# EAGLE schematic spectrometer_mother_board_v1 (EAGLE 9.2.2)
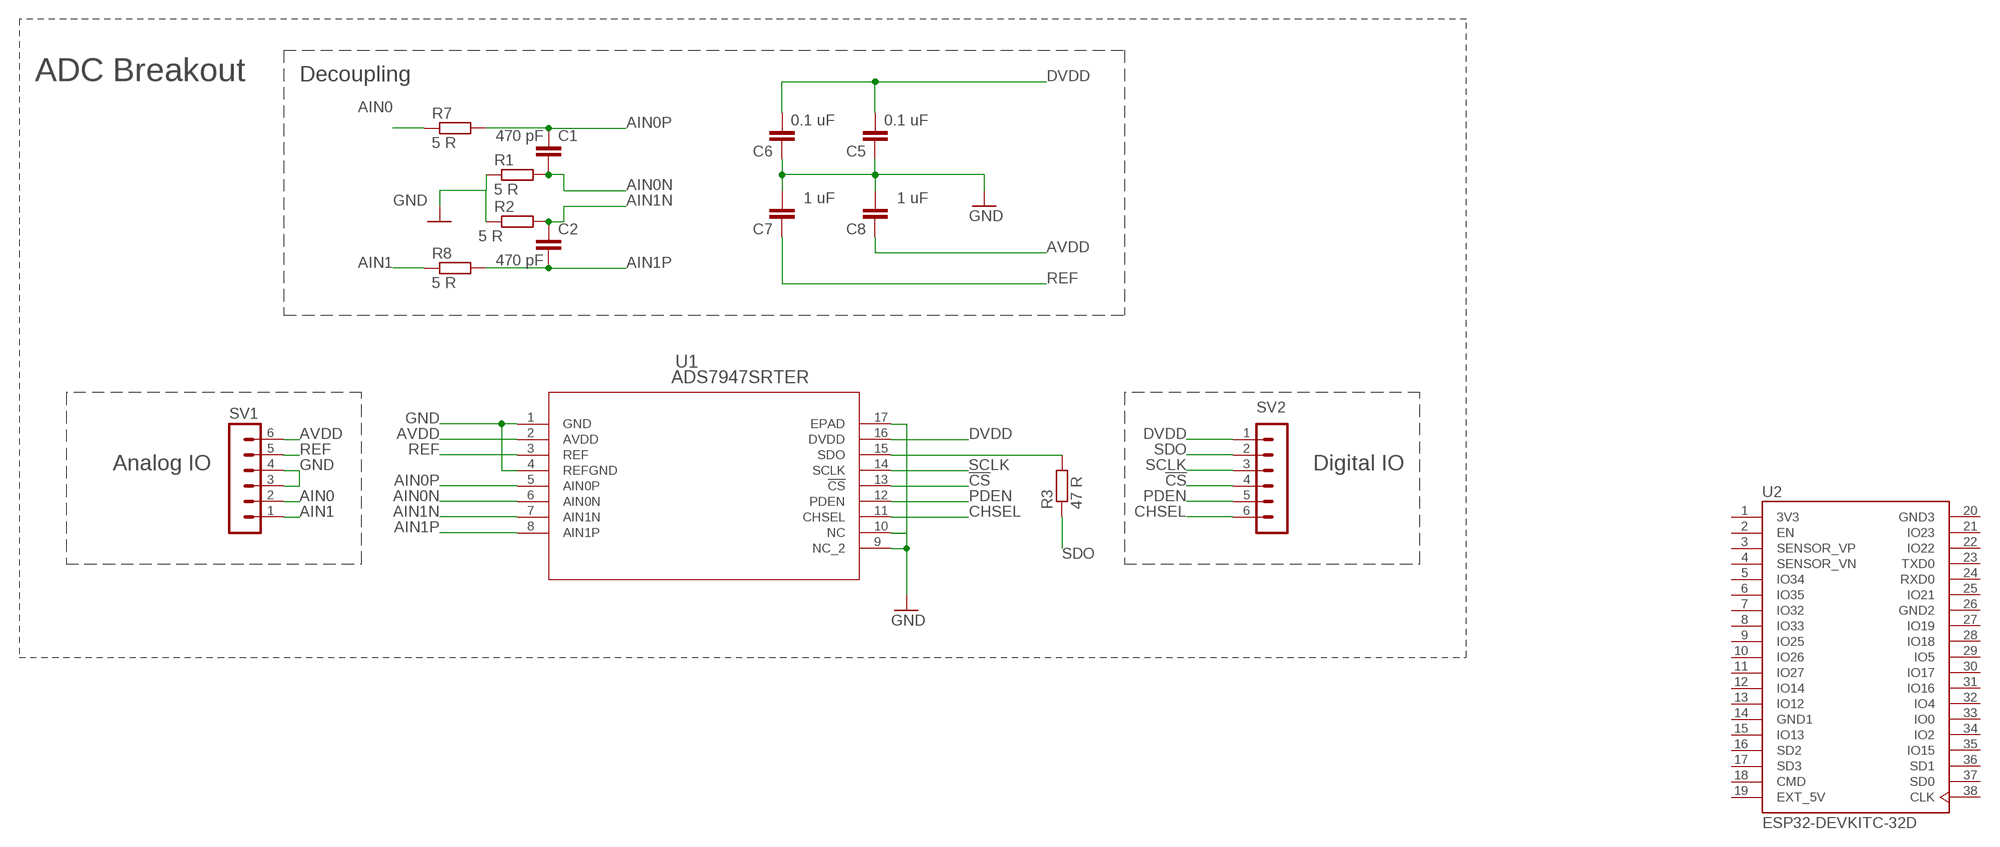
[diagram p0: schematic, sheet 1, part 1 of 2]
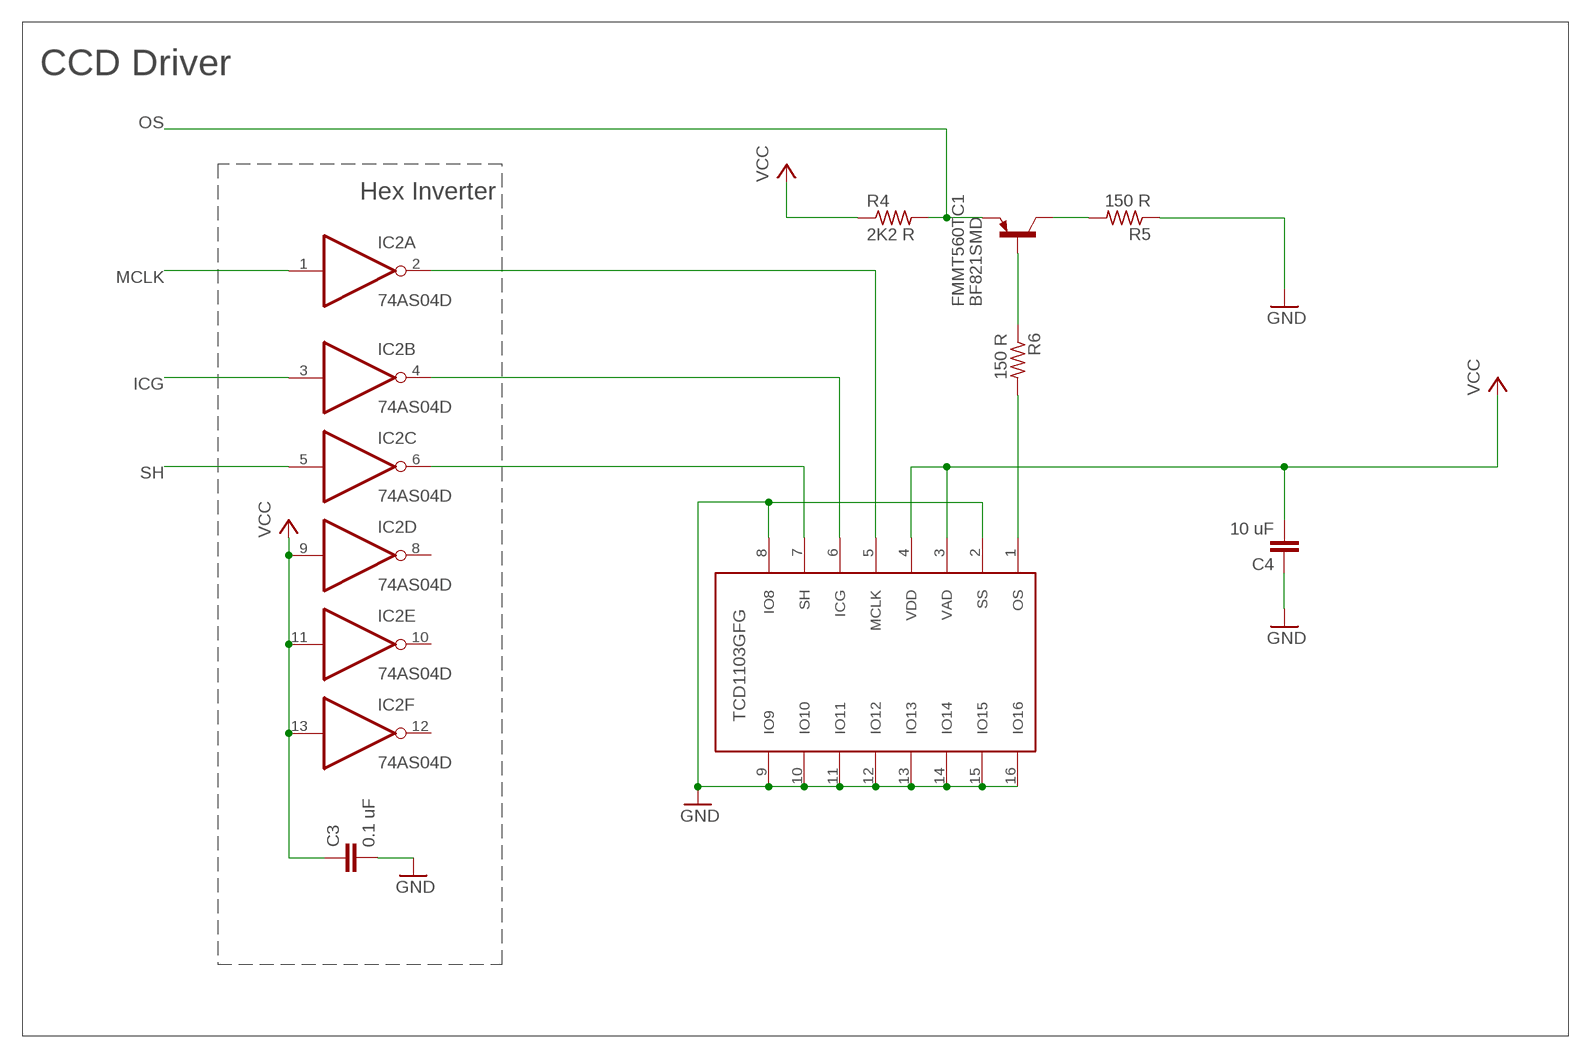
[diagram p1: schematic, sheet 1, part 2 of 2]

## Parts
C1  470 pF  C-EUC0603  [C0603]
C2  470 pF  C-EUC0603  [C0603]
C3  0.1 uF  C-EUC1210  [C1210]
C4  10 uF  C-EUC1210  [C1210]
C5  0.1 uF  C-EUC0603  [C0603]
C6  0.1 uF  C-EUC0603  [C0603]
C7  1 uF  C-EUC0603  [C0603]
C8  1 uF  C-EUC0603  [C0603]
FMMT560TC1  BF821SMD  [SOT23-BEC]
IC2  74AS04D  [SO14]
R1  5 R  R-EU_R0603  [R0603]
R2  5 R  R-EU_R0603  [R0603]
R3  47 R  R-EU_R0603  [R0603]
R4  2K2 R  R-US_R1206  [R1206]
R5  150 R  R-US_R1206  [R1206]
R6  150 R  R-US_R1206  [R1206]
R7  5 R  R-EU_R0603  [R0603]
R8  5 R  R-EU_R0603  [R0603]
SV1  MA06-1  [MA06-1]
SV2  MA06-1  [MA06-1]
U1  ADS7947SRTER  [RTE16_1P7X1P7]
U2  ESP32-DEVKITC-32D  [MODULE_ESP32-DEVKITC-32D]
U$2  TCD1103  [GLCC16]

## Nets
!CS: SV2.4 U1.13(!CS)
AIN0: R7.1 SV1.2
AIN0N: C1.2 R1.2 U1.6(AIN0N)
AIN0P: C1.1 R7.2 U1.5(AIN0P)
AIN1: R8.1 SV1.1
AIN1N: C2.1 R2.2 U1.7(AIN1N)
AIN1P: C2.2 R8.2 U1.8(AIN1P)
AVDD: C8.1 SV1.6 U1.2(AVDD)
CHSEL: SV2.6 U1.11(CHSEL)
DVDD: C5.2 C6.2 SV2.1 U1.16(DVDD)
GND: C3.2 C4.1 C5.1 C6.1 C7.2 C8.2 R1.1 R2.1 R5.1 SV1.3 SV1.4 U1.1(GND) U1.4(REFGND) U1.9(NC_2) U1.10(NC) U1.17(EPAD) U$2.2(SS) U$2.8(IO8) U$2.9(IO9) U$2.10(IO10) U$2.11(IO11) U$2.12(IO12) U$2.13(IO13) U$2.14(IO14) U$2.15(IO15) U$2.16(IO16)
ICG: IC2.3(B:I)
MCLK: IC2.1(A:I)
N$7: FMMT560TC1.C R5.2
N$8: FMMT560TC1.B R6.1
N$9: R6.2 U$2.1(OS)
N$10: IC2.2(A:O) U$2.5(MCLK)
N$11: IC2.4(B:O) U$2.6(ICG)
N$12: IC2.6(C:O) U$2.7(SH)
OS: FMMT560TC1.E R4.2
PDEN: SV2.5 U1.12(PDEN)
REF: C7.1 SV1.5 U1.3(REF)
SCLK: SV2.3 U1.14(SCLK)
SDO: R3.1 R3.2 SV2.2 U1.15(SDO)
SH: IC2.5(C:I)
VCC: C3.1 C4.2 IC2.9(D:I) IC2.11(E:I) IC2.13(F:I) R4.1 U$2.3(VAD) U$2.4(VDD)
Unconnected: IC2.8(D:O) IC2.10(E:O) IC2.12(F:O) U2.2(EN) U2.3(SENSOR_VP) U2.4(SENSOR_VN) U2.5(IO34) U2.6(IO35) U2.7(IO32) U2.8(IO33) U2.9(IO25) U2.10(IO26) U2.11(IO27) U2.12(IO14) U2.13(IO12) U2.15(IO13) U2.16(SD2) U2.17(SD3) U2.18(CMD) U2.21(IO23) U2.22(IO22) U2.23(TXD0) U2.24(RXD0) U2.25(IO21) U2.27(IO19) U2.28(IO18) U2.29(IO5) U2.30(IO17) U2.31(IO16) U2.32(IO4) U2.33(IO0) U2.34(IO2) U2.35(IO15) U2.36(SD1) U2.37(SD0) U2.38(CLK)

## Notes on the sheet
- ADC Breakout | Decoupling | CCD Driver
- Hex Inverter
- Digital IO
- Analog IO

## Power pins joined to a net without a drawn wire
3V3: U2.1(3V3)
EXT_5V: U2.19(EXT_5V)
GND: IC2.7(P:GND)
GND1: U2.14(GND1)
GND2: U2.26(GND2)
GND3: U2.20(GND3)
VCC: IC2.14(P:VCC)

## Library data of the parts
C1-C8 = rcl:C-EU: CAPACITOR, European symbol; SPICEPREFIX: C
FMMT560TC1 = transistor-pnp:BF821*: PNP Transistror
IC2 = 74xx-us:74*04: Hex INVERTER
R1-R3 R7 R8 = rcl:R-EU_: RESISTOR, European symbol; SPICEPREFIX: R
R4-R6 = rcl:R-US_: RESISTOR, American symbol; SPICEPREFIX: R
SV1 SV2 = con-lstb:MA06-1: PIN HEADER; OC_FARNELL: unknown; OC_NEWARK: unknown
U1 = ADS7947SRTER:ADS7947SRTER; DATASHEET_URL: http://www.ti.com/lit/gpn/ADS7947; DESCRIPTION: 12-Bit, 2 MSPS, Dual Channel, Pseudo-differential uPower Serial SAR ADC; FAMILY_NAME: PRECISION ADC (<=10MSPS); GENERIC_PART_NUMBER: ADS7947; INDUSTRY_STD_PKG_TYPE: WQFN; MANUFACTURER: Texas Instruments; PACKAGE_DESIGNATOR: RTE; PIN_COUNT: 16
U2 = ESP32-DEVKITC-32D:ESP32-DEVKITC-32D: Eval Board For Esp-Wroom-32; AVAILABILITY: Unavailable; DESCRIPTION: - Transceiver; 802.11 b/g/n _Wi-Fi, WiFi, WLAN_, Bluetooth® Smart Ready 4.x Dual Mode For Use With ESP-WROOM-32; MF: Espressif Systems; MP: ESP32-DEVKITC-32D; PACKAGE: None; PRICE: None
U$2 = TCD1103:TCD1103